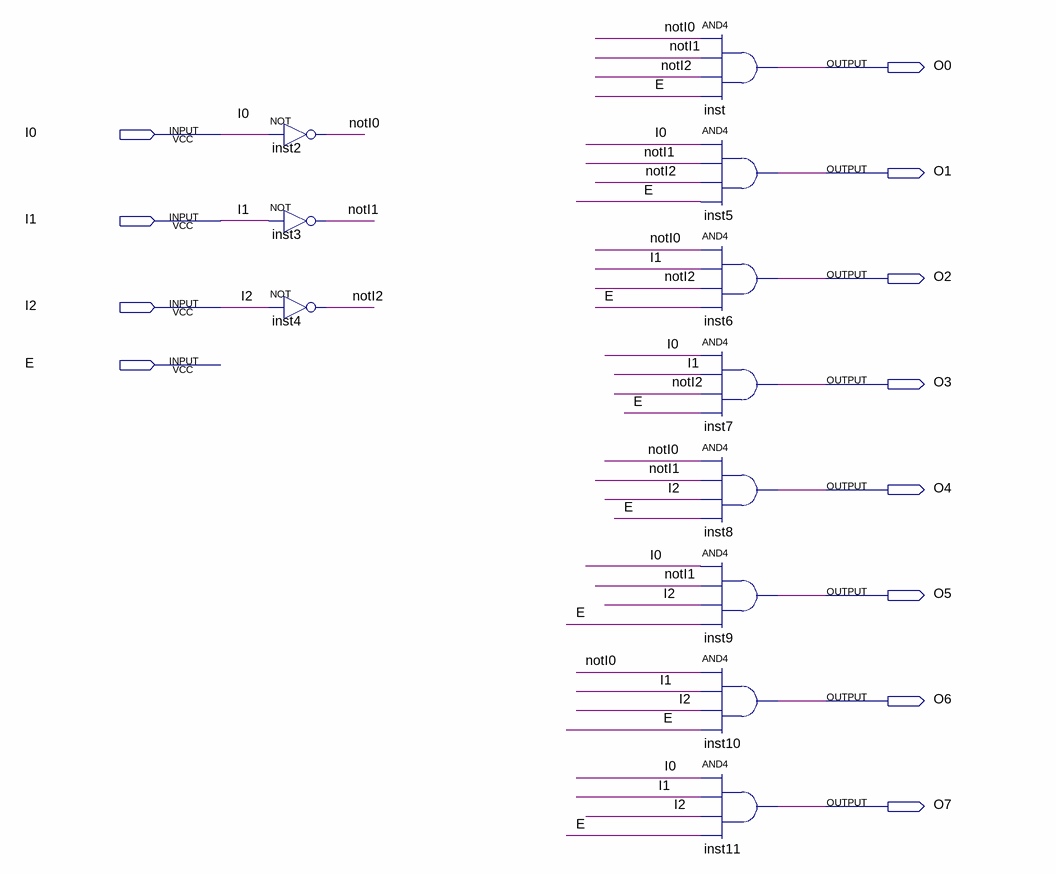
[diagram p0: schematic sheet]
// Quartus schematic DC3_8.bdf as structural Verilog: 11 symbols, 12 pins
module DC3_8 (
  input  I0,
  input  I1,
  input  I2,
  input  E,
  output O0,
  output O1,
  output O2,
  output O3,
  output O4,
  output O5,
  output O6,
  output O7
);

  wire notI0, notI1, notI2;

  not inst2 (notI0, I0);
  not inst3 (notI1, I1);
  not inst4 (notI2, I2);
  and inst (O0, notI0, notI1, notI2, E);
  and inst5 (O1, I0, notI1, notI2, E);
  and inst6 (O2, notI0, I1, notI2, E);
  and inst7 (O3, I0, I1, notI2, E);
  and inst8 (O4, notI0, notI1, I2, E);
  and inst9 (O5, I0, notI1, I2, E);
  and inst10 (O6, notI0, I1, I2, E);
  and inst11 (O7, I0, I1, I2, E);
endmodule
